# Altium schematic sheet ConditioningBoard_BSPD_V1.0.SchDoc
size A; SheetNumber: 1; SheetTotal: 1
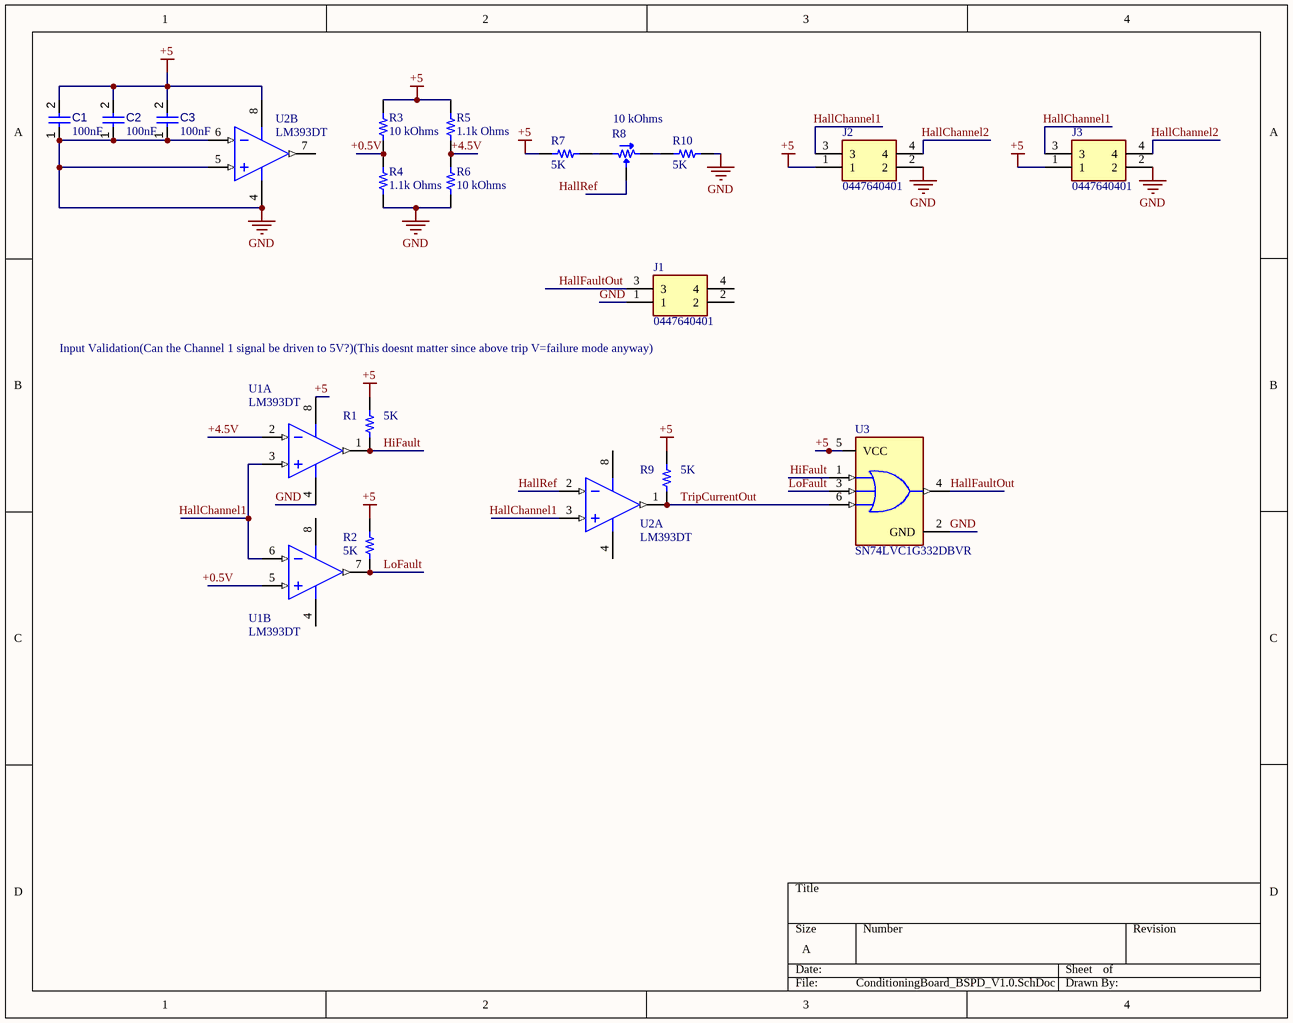
[diagram p0: ConditioningBoard_BSPD_V1.0.SchDoc]

## Parts
C1  value 100nF  [CAPC1608X90X40NL10T20]  (hidden comment: Capacitor 100 nF +/-10% 50 V 0603)
C2  value 100nF  [CAPC1608X90X40NL10T20]  (hidden comment: Capacitor 100 nF +/-10% 50 V 0603)
C3  value 100nF  [CAPC1608X90X40NL10T20]  (hidden comment: Capacitor 100 nF +/-10% 50 V 0603)
J1  0447640401  [0447640401]
J2  0447640401  [0447640401]
J3  0447640401  [0447640401]
R1  5K  [RES 0603_1608]
R2  5K  [RES 0603_1608]
R3  10 kOhms  [RES 0603_1608]
R4  1.1k Ohms  [RES 0603_1608]
R5  1.1k Ohms  [RES 0603_1608]
R6  10 kOhms  [RES 0603_1608]
R7  5K  [RES 0603_1608]
R8  10 kOhms  [POT BOURNS TRIMPOT TC33]
R9  5K  [RES 0603_1608]
R10  5K  [RES 0603_1608]
U1  LM393DT  [STM-SO-8_D_L]  (parts A,B of 2)
U2  LM393DT  [STM-SO-8_D_L]  (parts A,B of 2)
U3  SN74LVC1G332DBVR  [FP-DBV0006A-MFG]

## Nets
+5: C1.2 C2.2 C3.2 J2.1 J3.1 R1.1 R2.1 R3.2 R5.1 R7.1 R9.1 U1.8(VCC+) U2.8(VCC+) U3.5(VCC)
GND: C1.1 C2.1 C3.1 J1.1 J2.2 J3.2 R4.1 R6.1 R10.1 U1.4(VCC-) U2.4(VCC-) U2.5(IN2+) U2.6(IN2-) U3.2(GND)
+0.5V: R3.1 R4.2 U1.5(IN2+)
+4.5V: R5.2 R6.2 U1.2(IN1-)
HallChannel1: J2.3 J3.3 U1.3(IN1+) U1.6(IN2-) U2.3(IN1+)
HallChannel2: J2.4 J3.4
HallFaultOut: J1.3 U3.4(Y)
HallRef: R8.2 U2.2(IN1-)
HiFault: R1.2 U1.1(OUT1) U3.1(A)
LoFault: R2.2 U1.7(OUT2) U3.3(B)
TripCurrentOut: R9.2 U2.1(OUT1) U3.6(C)
NetR7_2: R7.2 R8.1
NetR8_3: R8.3 R10.2

Not connected (* = marked no-connect by the designer): J1 2 4; U2 7(OUT2)

## Notes on the sheet
- Input Validation(Can the Channel 1 signal be driven to 5V?)(This doesnt matter since above trip V=failure mode anyway)

## Library data of the parts
C1-C3 = CMP-001-00017-6: Chip Capacitor, 100 nF, +/- 10%, 50 V, 0603 (1608 Metric); Voltage Rating: 50V; Capacitor Type: Ceramic; Tolerance: 10%; Mounting Technology: SM; Max Operating Temperature: 125°C; RoHS Compliant: True; Pins: 2; Case/Package: 0603; Min Operating Temperature: -55°C
J1-J3 = 0447640401: Connector; Manufacturer_Name: Molex; Datasheet Link: https://www.molex.com/pdm_docs/ps/PS-44300-001.pdf; Height: 10.7mm; Manufacturer_Part_Number: 0447640401
R1 R2 R7 R9 R10 = CRGP0603F5K6: CRGP 0603 5K6 1%; Manufacturer: TE Connectivity Passive Product; Power (Watts): 0.25W, 1/4W; Resistance: 5.6 kOhms; Temperature Coefficient: ±100ppm/°C; Part Number: CRGP0603F5K6; Value: 5K; ComponentLink1Description: Datasheet; ComponentLink1URL: https://www.te.com/commerce/DocumentDelivery/DDEController?Action=srchrtrv&DocNm=9-1773463-9&DocType=DS&DocLang=English; ComponentLink2Description: DigiKey Link; ComponentLink2URL: http://digikey.com/product-detail/en/te-connectivity-passive-product/CRGP0603F5K6/A130425CT-ND/8578257; Composition: Thick Film; Device Package: 0603 (1608 Metric); Features: Pulse Withstanding; Height - Seated (Max): 0.022" (0.55mm); LastUpdated: 9/2/2020 1:09:50 AM; Lifecycle Status: Active; Minimum Order: 1; Number of Terminations: 2; Operating Temperature: -55°C ~ 155°C; Package / Case: 0603 (1608 Metric); Packaging: TapeAndReel; PartId: 20907; Part Status: Active; Price: 0.02; Series: CRGP; Size / Dimension: 0.063" L x 0.031" W (1.60mm x 0.80mm); Supplier 1: DigiKey; Supplier Part Number 1: A130425CT-ND; Supplier Device Package: 0603; Tolerance: ±1%
R3 R6 = CPF0603B10KE: RES SMD 10K OHM 0.1% 1/16W 0603; Manufacturer: TE Connectivity Passive Product; Power (Watts): 0.063W, 1/16W; Temperature Coefficient: ±25ppm/°C; Part Number: CPF0603B10KE; Value: 10 kOhms; ComponentLink1Description: Datasheet; ComponentLink1URL: https://www.te.com/commerce/DocumentDelivery/DDEController?Action=srchrtrv&DocNm=1773200&DocType=DS&DocLang=English; ComponentLink2Description: DigiKey Link; ComponentLink2URL: http://digikey.com/product-detail/en/te-connectivity-passive-product/CPF0603B10KE/A119886CT-ND/4966484; Composition: Thin Film; Device Package: 0603 (1608 Metric); Height - Seated (Max): 0.022" (0.55mm); LastUpdated: 9/2/2020 1:10:25 AM; Lifecycle Status: Active; Minimum Order: 1; Number of Terminations: 2; Operating Temperature: -55°C ~ 155°C; Package / Case: 0603 (1608 Metric); Packaging: TapeAndReel; PartId: 4872; Part Status: Active; Price: 0.09; Resistance: 10 kOhms; Series: CPF, Neohm; Size / Dimension: 0.061" L x 0.031" W (1.55mm x 0.80mm); Supplier 1: DigiKey; Supplier Part Number 1: A119886CT-ND; Supplier Device Package: 0603; Tolerance: ±0.1%
R4 R5 = RK73H1JTTD4420F: RES 442 OHM 1% 1/8W 0603; Manufacturer: KOA Speer Electronics, Inc.; Power (Watts): 0.125W, 1/8W; Resistance: 442 Ohms; Temperature Coefficient: ±100ppm/°C; Part Number: RK73H1JTTD4420F; Value: 1.1k Ohms; ComponentLink1Description: Datasheet; ComponentLink1URL: http://www.koaspeer.com/catimages/Products/RK73H/RK73H.pdf; ComponentLink2Description: DigiKey Link; ComponentLink2URL: http://digikey.com/product-detail/en/koa-speer-electronics-inc/RK73H1JTTD4420F/2019-RK73H1JTTD4420FCT-ND/9847257; Composition: Thick Film; Device Package: 0603 (1608 Metric); Features: Automotive AEC-Q200, Moisture Resistant; Height - Seated (Max): 0.022" (0.55mm); LastUpdated: 9/2/2020 1:09:26 AM; Lifecycle Status: Active; Minimum Order: 1; Number of Terminations: 2; Operating Temperature: -55°C ~ 155°C; Package / Case: 0603 (1608 Metric); Packaging: CutTape; PartId: 26603; Part Status: Active; Price: 0.10; Ratings: AEC-Q200; Series: RK73H; Size / Dimension: 0.063" L x 0.031" W (1.60mm x 0.80mm); Supplier 1: DigiKey; Supplier Part Number 1: 2019-RK73H1JTTD4420FCT-ND; Supplier Device Package: 0603; Tolerance: ±1%
R8 = TC33X-2-103E: TRIMMER 10K OHM 0.1W J LEAD TOP; Manufacturer: Bourns Inc.; Adjustment Type: Top Adjustment; Number of Turns: 1; Power (Watts): 0.1W, 1/10W; Resistive Material: Cermet; Temperature Coefficient: ±250ppm/°C; Tolerance: ±25%; Part Number: TC33X-2-103E; ComponentLink1Description: Datasheet; ComponentLink1URL: https://www.bourns.com/docs/Product-Datasheets/TC33.pdf; ComponentLink2Description: DigiKey Link; ComponentLink2URL: http://digikey.com/product-detail/en/bourns-inc/TC33X-2-103E/TC33X-103ECT-ND/612911; LastUpdated: 9/2/2020 1:21:42 AM; Lifecycle Status: Active; Minimum Order: 1; Mounting Type: Surface Mount; Packaging: TapeAndReel; PartId: 8; Part Status: Active; Price: 0.15; Resistance: 10 kOhms; Series: Trimpot® TC33 - Open Frame; Size / Dimension: Rectangular - 0.150" x 0.142" Face x 0.047" H (3.80mm x 3.60mm x 1.20mm); Supplier 1: DigiKey; Supplier Part Number 1: TC33X-103ECT-ND; Termination Style: J Lead; Value: 10 kOhms
U1 U2 = CMP-2000-06550-1: Low-Power, Dual-Voltage Comparator, 2 to 36 V, 0 to 70 degC, 8-Pin SOIC (SO), RoHS, Tape and Reel; Manufacturer: STMicroelectronics; Voltage - Supply, Single/Dual (±): 2V~36V,±1V~18V; Current - Input Bias (Max): 0.25µA@5V; Number of Elements: 2; Current - Output (Typ): 18mA@5V; Other Names: 497-1593-2; Voltage - Input Offset (Max): 5mV@30V; Output Type: CMOS,DTL,ECL,MOS,Open-Collector,TTL; EDA / CAD Models: DownloadfromAcceleratedDesigns; Other Related Documents: LM393ViewAllSpecificationsLM393ViewAllSpecifications; Online Catalog: Comparators-2elements; Current - Quiescent (Max): 2.5mA; Standard Package: 2,500; Manufacturer URL: http://www.st.com/; Package Description: 8-Pin Small Outline Integrated Circuit, Body 4.9 x 3.9 mm, Pitch 1.27 mm; Packaging: Tape&Reel(TR); Datasheet Version: Rev. 15, 02/2016; Category: IntegratedCircuits(ICs); Operating Temperature: 0°C~70°C; Mounting Type: SurfaceMount; Supplier Device Package: 8-SO; Datasheet URL: http://www.st.com/content/ccc/resource/technical/document/datasheet/group1/b4/cc/cf/13/18/28/44/f5/CD00000465/files/CD00000465.pdf/jcr:content/translations/en.CD00000465.pdf; Family: Linear-Comparators; Mounting Technology: SurfaceMount; Type: GeneralPurpose; Package Reference: SO-8; Package / Case: 8-SOIC(0.154",3.90mmWidth)
U3 = CMP-0859-00188-4: IC GATE OR 1CH 3-INP SOT23-6; Manufacturer: TEXAS INSTRUMENTS; Number Of Inputs: 3; Description: OR Gate IC 1 Channel  SOT-23-6; Nominal Supply Current: 10-500uA; Number Of Circuits: 1; Max Supply Voltage: 5.5V; Standoff Height: 0mm; Propagation Delay: 4.5ns; Min Supply Voltage: 1.5V; Height: 1.45mm; Temperature Range High: +125°C; Device Class L3: Logic Gates; Device Class L2: Logic ICs; Lead Free: Yes; Temperature Range Low: -40°C; ComponentLink2URL: http://www.ti.com/lit/ds/symlink/sn74lvc1g332.pdf; Package: DBV0006A; ComponentLink2Description: Datasheet; Octopart: https://octopart.com/sn74lvc1g332dbvr-texas+instruments-464996; Category: IC; Automotive: No; Manufacturer Part Number: SN74LVC1G332DBVR; Ipc Land Pattern Name: SOT95P280X145-6; Logic Function Desc: OR; Ambient Temperature Range Low: -40°C; Temperature: -40°C to +125°C; Number Of Outputs: 1; Mouser Description: Logic Gates Sngl 3 Inpt + OR Gt; RoHS: TRUE; Ambient Temperature Range High: +125°C; Device Class L1: Integrated Circuits (ICs); Digikey Description: IC GATE OR 1CH 3-INP SOT23-6